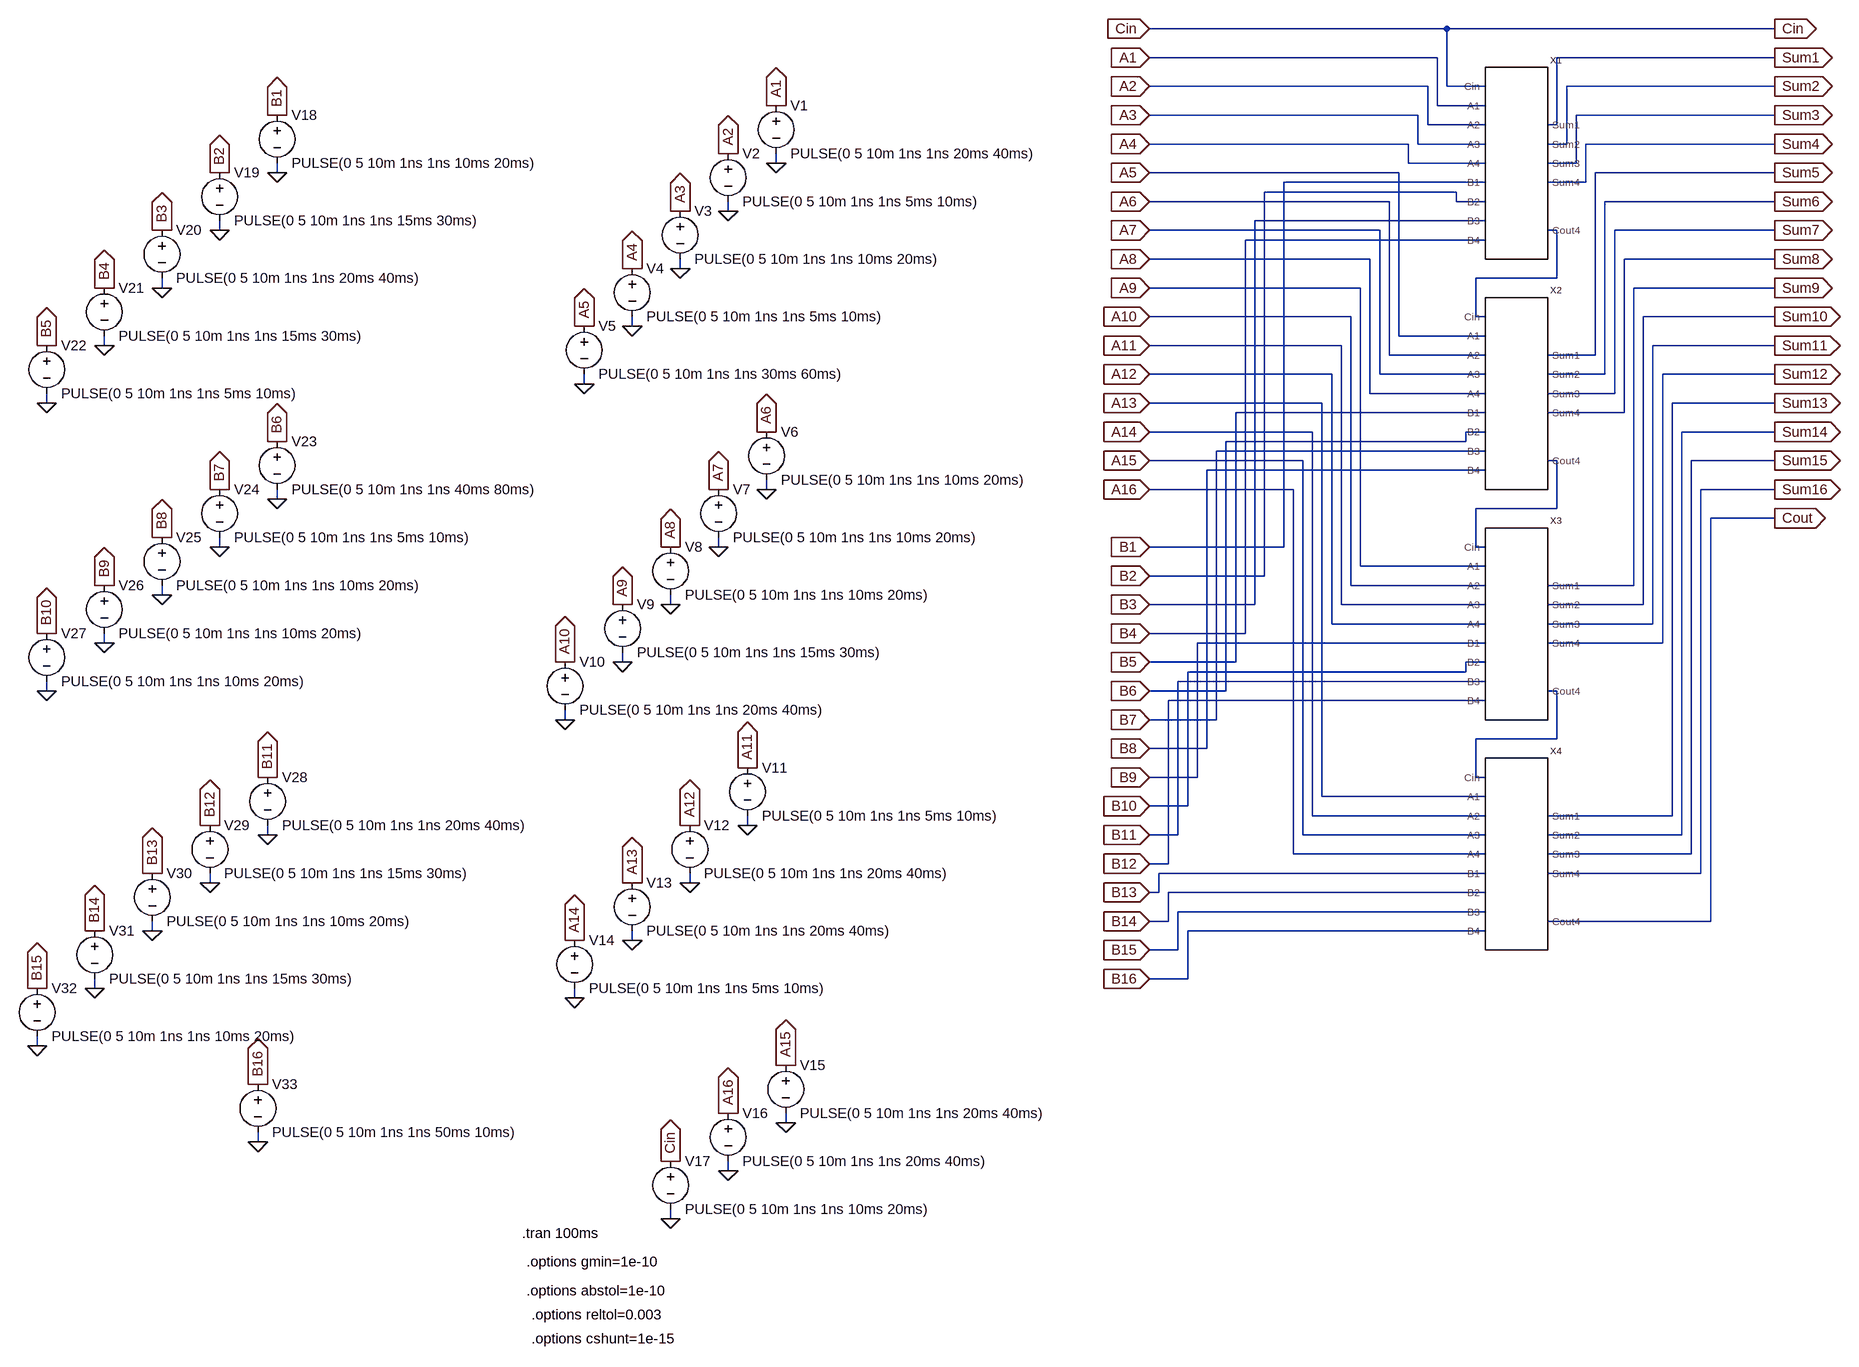
[diagram p0: schematic 16_bit_Full_Adder.asc]
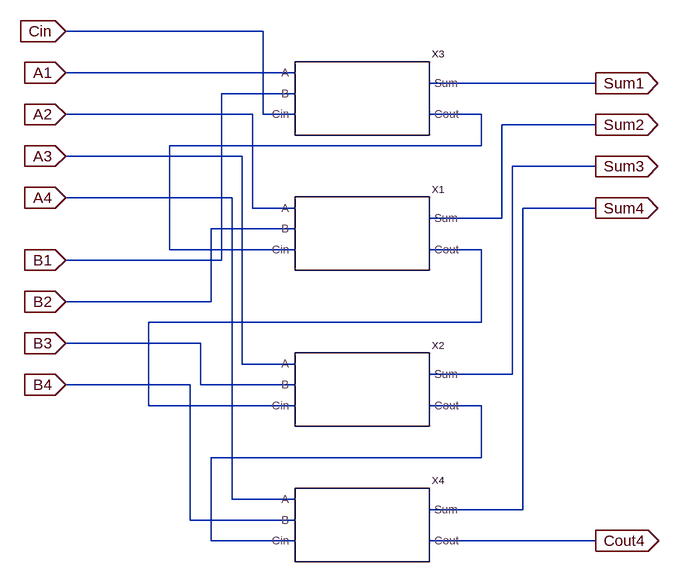
[diagram p1: sub-circuit 8pin_in_full_adder.asc]
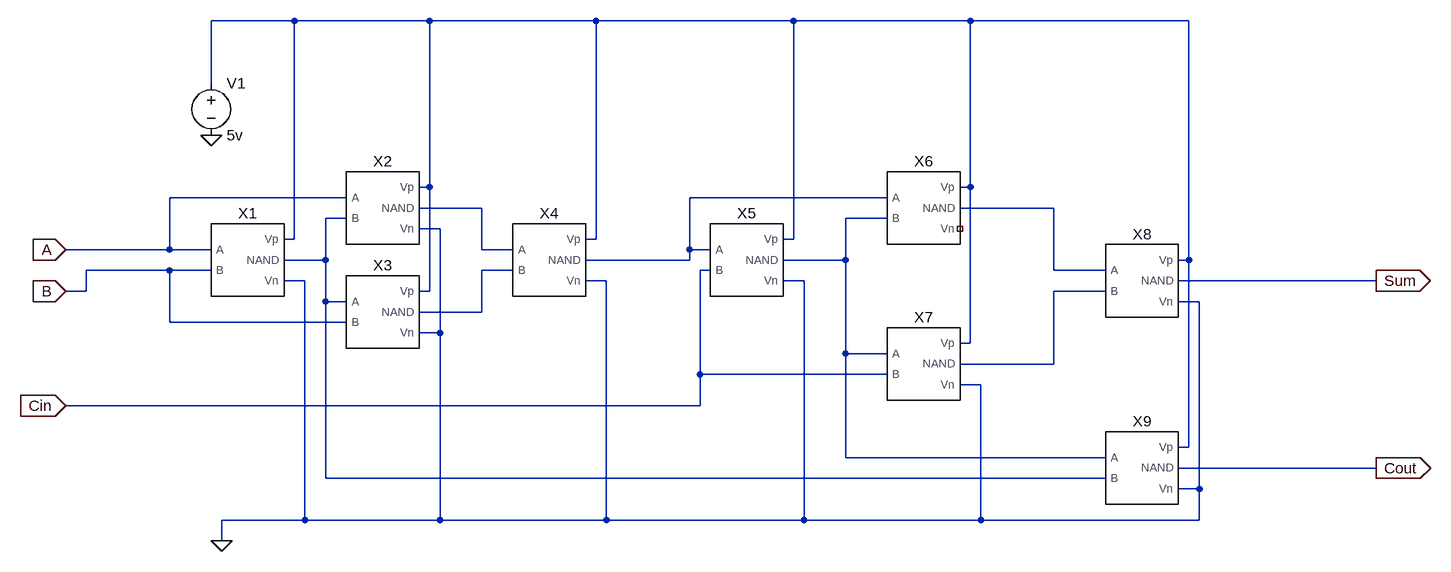
[diagram p2: sub-circuit 1_bit_full_adder.asc]
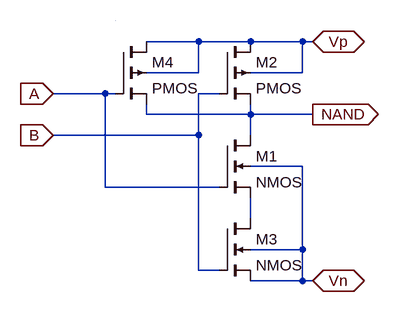
[diagram p3: sub-circuit cmos-nand.asc]
16_bit_Full_Adder.asc, the LTspice schematic file:
Version 4
SHEET 1 880 2136
WIRE -528 -64 -1024 -64
WIRE 112 -64 -528 -64
WIRE -544 -16 -1024 -16
WIRE 112 -16 -256 -16
WIRE -560 32 -1024 32
WIRE -528 32 -528 -64
WIRE -464 32 -528 32
WIRE 112 32 -240 32
WIRE -544 64 -544 -16
WIRE -464 64 -544 64
WIRE -576 80 -1024 80
WIRE 112 80 -224 80
WIRE -560 96 -560 32
WIRE -464 96 -560 96
WIRE -256 96 -256 -16
WIRE -256 96 -272 96
WIRE -592 128 -1024 128
WIRE -576 128 -576 80
WIRE -464 128 -576 128
WIRE -240 128 -240 32
WIRE -240 128 -272 128
WIRE 112 128 -208 128
WIRE -2016 160 -2016 144
WIRE -592 160 -592 128
WIRE -464 160 -592 160
WIRE -224 160 -224 80
WIRE -224 160 -272 160
WIRE -2848 176 -2848 160
WIRE -608 176 -1024 176
WIRE 112 176 -192 176
WIRE -464 192 -800 192
WIRE -208 192 -208 128
WIRE -208 192 -272 192
WIRE -512 208 -832 208
WIRE -624 224 -1024 224
WIRE -512 224 -512 208
WIRE -464 224 -512 224
WIRE 112 224 -176 224
WIRE -2096 240 -2096 224
WIRE -464 256 -848 256
WIRE -2944 272 -2944 256
WIRE -640 272 -1024 272
WIRE -256 272 -272 272
WIRE 112 272 -160 272
WIRE -464 288 -864 288
WIRE -656 320 -1024 320
WIRE 112 320 -144 320
WIRE -2176 336 -2176 320
WIRE -256 352 -256 272
WIRE -256 352 -480 352
WIRE -3040 368 -3040 352
WIRE -672 368 -1024 368
WIRE 112 368 -128 368
WIRE -688 416 -1024 416
WIRE -480 416 -480 352
WIRE -464 416 -480 416
WIRE 112 416 -112 416
WIRE -2256 432 -2256 416
WIRE -608 448 -608 176
WIRE -464 448 -608 448
WIRE -3136 464 -3136 448
WIRE -704 464 -1024 464
WIRE 112 464 -96 464
WIRE -624 480 -624 224
WIRE -464 480 -624 480
WIRE -192 480 -192 176
WIRE -192 480 -272 480
WIRE -720 512 -1024 512
WIRE -640 512 -640 272
WIRE -464 512 -640 512
WIRE -176 512 -176 224
WIRE -176 512 -272 512
WIRE 112 512 -80 512
WIRE -2336 528 -2336 512
WIRE -656 544 -656 320
WIRE -464 544 -656 544
WIRE -160 544 -160 272
WIRE -160 544 -272 544
WIRE -3232 560 -3232 544
WIRE -736 560 -1024 560
WIRE 112 560 -64 560
WIRE -464 576 -880 576
WIRE -144 576 -144 320
WIRE -144 576 -272 576
WIRE -752 608 -1024 608
WIRE -464 608 -496 608
WIRE 112 608 -48 608
WIRE -496 624 -496 608
WIRE -496 624 -896 624
WIRE -464 640 -912 640
WIRE -768 656 -1024 656
WIRE -256 656 -272 656
WIRE 112 656 -32 656
WIRE -464 672 -928 672
WIRE -2032 704 -2032 688
WIRE -784 704 -1024 704
WIRE 112 704 -16 704
WIRE -2848 720 -2848 704
WIRE -256 736 -256 656
WIRE -256 736 -480 736
WIRE 112 752 0 752
WIRE -2944 800 -2944 784
WIRE -2112 800 -2112 784
WIRE -800 800 -800 192
WIRE -800 800 -1024 800
WIRE -480 800 -480 736
WIRE -464 800 -480 800
WIRE -672 832 -672 368
WIRE -464 832 -672 832
WIRE -832 848 -832 208
WIRE -832 848 -1024 848
WIRE -688 864 -688 416
WIRE -464 864 -688 864
WIRE -128 864 -128 368
WIRE -128 864 -272 864
WIRE -3040 880 -3040 864
WIRE -2192 896 -2192 880
WIRE -848 896 -848 256
WIRE -848 896 -1024 896
WIRE -704 896 -704 464
WIRE -464 896 -704 896
WIRE -112 896 -112 416
WIRE -112 896 -272 896
WIRE -720 928 -720 512
WIRE -464 928 -720 928
WIRE -96 928 -96 464
WIRE -96 928 -272 928
WIRE -864 944 -864 288
WIRE -864 944 -1024 944
WIRE -3136 960 -3136 944
WIRE -464 960 -944 960
WIRE -80 960 -80 512
WIRE -80 960 -272 960
WIRE -2272 992 -2272 976
WIRE -880 992 -880 576
WIRE -880 992 -1024 992
WIRE -464 992 -496 992
WIRE -496 1008 -496 992
WIRE -496 1008 -960 1008
WIRE -464 1024 -976 1024
WIRE -3232 1040 -3232 1024
WIRE -896 1040 -896 624
WIRE -896 1040 -1024 1040
WIRE -256 1040 -272 1040
WIRE -464 1056 -992 1056
WIRE -2368 1088 -2368 1072
WIRE -912 1088 -912 640
WIRE -912 1088 -1024 1088
WIRE -256 1120 -256 1040
WIRE -256 1120 -480 1120
WIRE -928 1136 -928 672
WIRE -928 1136 -1024 1136
WIRE -944 1184 -944 960
WIRE -944 1184 -1024 1184
WIRE -480 1184 -480 1120
WIRE -464 1184 -480 1184
WIRE -736 1216 -736 560
WIRE -464 1216 -736 1216
WIRE -960 1232 -960 1008
WIRE -960 1232 -1024 1232
WIRE -752 1248 -752 608
WIRE -464 1248 -752 1248
WIRE -64 1248 -64 560
WIRE -64 1248 -272 1248
WIRE -2064 1264 -2064 1248
WIRE -2864 1280 -2864 1264
WIRE -976 1280 -976 1024
WIRE -976 1280 -1024 1280
WIRE -768 1280 -768 656
WIRE -464 1280 -768 1280
WIRE -48 1280 -48 608
WIRE -48 1280 -272 1280
WIRE -784 1312 -784 704
WIRE -464 1312 -784 1312
WIRE -32 1312 -32 656
WIRE -32 1312 -272 1312
WIRE -992 1328 -992 1056
WIRE -992 1328 -1024 1328
WIRE -464 1344 -1008 1344
WIRE -16 1344 -16 704
WIRE -16 1344 -272 1344
WIRE -2960 1360 -2960 1344
WIRE -2160 1360 -2160 1344
WIRE -1008 1376 -1008 1344
WIRE -1008 1376 -1024 1376
WIRE -464 1376 -992 1376
WIRE -464 1408 -976 1408
WIRE -992 1424 -992 1376
WIRE -992 1424 -1024 1424
WIRE 0 1424 0 752
WIRE 0 1424 -272 1424
WIRE -3056 1440 -3056 1424
WIRE -464 1440 -960 1440
WIRE -2256 1456 -2256 1440
WIRE -976 1472 -976 1408
WIRE -976 1472 -1024 1472
WIRE -960 1520 -960 1440
WIRE -960 1520 -1024 1520
WIRE -3152 1536 -3152 1520
WIRE -2352 1552 -2352 1536
WIRE -3248 1632 -3248 1616
WIRE -2000 1760 -2000 1744
WIRE -2880 1792 -2880 1776
WIRE -2096 1840 -2096 1824
WIRE -2192 1920 -2192 1904
FLAG 112 752 Cout
IOPIN 112 752 Out
FLAG -1024 -16 A1
IOPIN -1024 -16 In
FLAG -1024 32 A2
IOPIN -1024 32 In
FLAG -1024 80 A3
IOPIN -1024 80 In
FLAG -1024 -64 Cin
IOPIN -1024 -64 In
FLAG -1024 128 A4
IOPIN -1024 128 In
FLAG -1024 176 A5
IOPIN -1024 176 In
FLAG -1024 224 A6
IOPIN -1024 224 In
FLAG -1024 272 A7
IOPIN -1024 272 In
FLAG -1024 320 A8
IOPIN -1024 320 In
FLAG -1024 368 A9
IOPIN -1024 368 In
FLAG -1024 416 A10
IOPIN -1024 416 In
FLAG -1024 464 A11
IOPIN -1024 464 In
FLAG -1024 512 A12
IOPIN -1024 512 In
FLAG -1024 560 A13
IOPIN -1024 560 In
FLAG -1024 608 A14
IOPIN -1024 608 In
FLAG -1024 656 A15
IOPIN -1024 656 In
FLAG -1024 704 A16
IOPIN -1024 704 In
FLAG -1024 800 B1
IOPIN -1024 800 In
FLAG -1024 848 B2
IOPIN -1024 848 In
FLAG -1024 896 B3
IOPIN -1024 896 In
FLAG -1024 944 B4
IOPIN -1024 944 In
FLAG -1024 992 B5
IOPIN -1024 992 In
FLAG -1024 1040 B6
IOPIN -1024 1040 In
FLAG -1024 1088 B7
IOPIN -1024 1088 In
FLAG -1024 1136 B8
IOPIN -1024 1136 In
FLAG -1024 1184 B9
IOPIN -1024 1184 In
FLAG -1024 1232 B10
IOPIN -1024 1232 In
FLAG -1024 1280 B11
IOPIN -1024 1280 In
FLAG -1024 1328 B12
IOPIN -1024 1328 In
FLAG -1024 1376 B13
IOPIN -1024 1376 In
FLAG -1024 1424 B14
IOPIN -1024 1424 In
FLAG -1024 1472 B15
IOPIN -1024 1472 In
FLAG -1024 1520 B16
IOPIN -1024 1520 In
FLAG 112 -16 Sum1
IOPIN 112 -16 Out
FLAG 112 -64 Cin
IOPIN 112 -64 Out
FLAG 112 32 Sum2
IOPIN 112 32 Out
FLAG 112 80 Sum3
IOPIN 112 80 Out
FLAG 112 128 Sum4
IOPIN 112 128 Out
FLAG 112 176 Sum5
IOPIN 112 176 Out
FLAG 112 224 Sum6
IOPIN 112 224 Out
FLAG 112 272 Sum7
IOPIN 112 272 Out
FLAG 112 320 Sum8
IOPIN 112 320 Out
FLAG 112 368 Sum9
IOPIN 112 368 Out
FLAG 112 416 Sum10
IOPIN 112 416 Out
FLAG 112 464 Sum11
IOPIN 112 464 Out
FLAG 112 512 Sum12
IOPIN 112 512 Out
FLAG 112 560 Sum13
IOPIN 112 560 Out
FLAG 112 608 Sum14
IOPIN 112 608 Out
FLAG 112 656 Sum15
IOPIN 112 656 Out
FLAG 112 704 Sum16
IOPIN 112 704 Out
FLAG -2016 64 A1
IOPIN -2016 64 Out
FLAG -2016 160 0
FLAG -2096 144 A2
IOPIN -2096 144 Out
FLAG -2176 240 A3
IOPIN -2176 240 Out
FLAG -2256 336 A4
IOPIN -2256 336 Out
FLAG -2336 432 A5
IOPIN -2336 432 Out
FLAG -2032 608 A6
IOPIN -2032 608 Out
FLAG -2112 704 A7
IOPIN -2112 704 Out
FLAG -2192 800 A8
IOPIN -2192 800 Out
FLAG -2272 896 A9
IOPIN -2272 896 Out
FLAG -2368 992 A10
IOPIN -2368 992 Out
FLAG -2064 1168 A11
IOPIN -2064 1168 Out
FLAG -2160 1264 A12
IOPIN -2160 1264 Out
FLAG -2256 1360 A13
IOPIN -2256 1360 Out
FLAG -2352 1456 A14
IOPIN -2352 1456 Out
FLAG -2000 1664 A15
IOPIN -2000 1664 Out
FLAG -2096 1744 A16
IOPIN -2096 1744 Out
FLAG -2096 240 0
FLAG -2176 336 0
FLAG -2256 432 0
FLAG -2336 528 0
FLAG -2032 704 0
FLAG -2112 800 0
FLAG -2192 896 0
FLAG -2272 992 0
FLAG -2368 1088 0
FLAG -2064 1264 0
FLAG -2160 1360 0
FLAG -2256 1456 0
FLAG -2352 1552 0
FLAG -2000 1760 0
FLAG -2096 1840 0
FLAG -2192 1920 0
FLAG -2192 1824 Cin
IOPIN -2192 1824 Out
FLAG -2848 80 B1
IOPIN -2848 80 Out
FLAG -2944 176 B2
IOPIN -2944 176 Out
FLAG -3040 272 B3
IOPIN -3040 272 Out
FLAG -3136 368 B4
IOPIN -3136 368 Out
FLAG -3232 464 B5
IOPIN -3232 464 Out
FLAG -2848 624 B6
IOPIN -2848 624 Out
FLAG -2944 704 B7
IOPIN -2944 704 Out
FLAG -3040 784 B8
IOPIN -3040 784 Out
FLAG -3136 864 B9
IOPIN -3136 864 Out
FLAG -3232 944 B10
IOPIN -3232 944 Out
FLAG -2864 1184 B11
IOPIN -2864 1184 Out
FLAG -2960 1264 B12
IOPIN -2960 1264 Out
FLAG -3056 1344 B13
IOPIN -3056 1344 Out
FLAG -3152 1440 B14
IOPIN -3152 1440 Out
FLAG -3248 1536 B15
IOPIN -3248 1536 Out
FLAG -2880 1696 B16
IOPIN -2880 1696 Out
FLAG -2848 176 0
FLAG -2944 272 0
FLAG -3040 368 0
FLAG -3136 464 0
FLAG -3232 560 0
FLAG -2848 720 0
FLAG -2944 800 0
FLAG -3040 880 0
FLAG -3136 960 0
FLAG -3232 1040 0
FLAG -2864 1280 0
FLAG -2960 1360 0
FLAG -3056 1440 0
FLAG -3152 1536 0
FLAG -3248 1632 0
FLAG -2880 1792 0
SYMBOL 8pin_in_Full_Adder -320 128 R0
SYMATTR InstName X1
SYMBOL 8pin_in_Full_Adder -320 512 R0
SYMATTR InstName X2
SYMBOL 8pin_in_Full_Adder -320 896 R0
SYMATTR InstName X3
SYMBOL 8pin_in_Full_Adder -320 1280 R0
SYMATTR InstName X4
SYMBOL voltage -2016 48 R0
WINDOW 123 0 0 Left 0
WINDOW 39 0 0 Left 0
SYMATTR InstName V1
SYMATTR Value PULSE(0 5 10m 1ns 1ns 20ms 40ms)
SYMBOL voltage -2096 128 R0
WINDOW 123 0 0 Left 0
WINDOW 39 0 0 Left 0
SYMATTR InstName V2
SYMATTR Value PULSE(0 5 10m 1ns 1ns 5ms 10ms)
SYMBOL voltage -2176 224 R0
WINDOW 123 0 0 Left 0
WINDOW 39 0 0 Left 0
SYMATTR InstName V3
SYMATTR Value PULSE(0 5 10m 1ns 1ns 10ms 20ms)
SYMBOL voltage -2256 320 R0
WINDOW 123 0 0 Left 0
WINDOW 39 0 0 Left 0
SYMATTR InstName V4
SYMATTR Value PULSE(0 5 10m 1ns 1ns 5ms 10ms)
SYMBOL voltage -2336 416 R0
WINDOW 123 0 0 Left 0
WINDOW 39 0 0 Left 0
SYMATTR InstName V5
SYMATTR Value PULSE(0 5 10m 1ns 1ns 30ms 60ms)
SYMBOL voltage -2032 592 R0
WINDOW 123 0 0 Left 0
WINDOW 39 0 0 Left 0
SYMATTR InstName V6
SYMATTR Value PULSE(0 5 10m 1ns 1ns 10ms 20ms)
SYMBOL voltage -2112 688 R0
WINDOW 123 0 0 Left 0
WINDOW 39 0 0 Left 0
SYMATTR InstName V7
SYMATTR Value PULSE(0 5 10m 1ns 1ns 10ms 20ms)
SYMBOL voltage -2192 784 R0
WINDOW 123 0 0 Left 0
WINDOW 39 0 0 Left 0
SYMATTR InstName V8
SYMATTR Value PULSE(0 5 10m 1ns 1ns 10ms 20ms)
SYMBOL voltage -2272 880 R0
WINDOW 123 0 0 Left 0
WINDOW 39 0 0 Left 0
SYMATTR InstName V9
SYMATTR Value PULSE(0 5 10m 1ns 1ns 15ms 30ms)
SYMBOL voltage -2368 976 R0
WINDOW 123 0 0 Left 0
WINDOW 39 0 0 Left 0
SYMATTR InstName V10
SYMATTR Value PULSE(0 5 10m 1ns 1ns 20ms 40ms)
SYMBOL voltage -2064 1152 R0
WINDOW 123 0 0 Left 0
WINDOW 39 0 0 Left 0
SYMATTR InstName V11
SYMATTR Value PULSE(0 5 10m 1ns 1ns 5ms 10ms)
SYMBOL voltage -2160 1248 R0
WINDOW 123 0 0 Left 0
WINDOW 39 0 0 Left 0
SYMATTR InstName V12
SYMATTR Value PULSE(0 5 10m 1ns 1ns 20ms 40ms)
SYMBOL voltage -2256 1344 R0
WINDOW 123 0 0 Left 0
WINDOW 39 0 0 Left 0
SYMATTR InstName V13
SYMATTR Value PULSE(0 5 10m 1ns 1ns 20ms 40ms)
SYMBOL voltage -2352 1440 R0
WINDOW 123 0 0 Left 0
WINDOW 39 0 0 Left 0
SYMATTR InstName V14
SYMATTR Value PULSE(0 5 10m 1ns 1ns 5ms 10ms)
SYMBOL voltage -2000 1648 R0
WINDOW 123 0 0 Left 0
WINDOW 39 0 0 Left 0
SYMATTR InstName V15
SYMATTR Value PULSE(0 5 10m 1ns 1ns 20ms 40ms)
SYMBOL voltage -2096 1728 R0
WINDOW 123 0 0 Left 0
WINDOW 39 0 0 Left 0
SYMATTR InstName V16
SYMATTR Value PULSE(0 5 10m 1ns 1ns 20ms 40ms)
SYMBOL voltage -2192 1808 R0
WINDOW 123 0 0 Left 0
WINDOW 39 0 0 Left 0
SYMATTR InstName V17
SYMATTR Value PULSE(0 5 10m 1ns 1ns 10ms 20ms)
SYMBOL voltage -2848 64 R0
WINDOW 123 0 0 Left 0
WINDOW 39 0 0 Left 0
SYMATTR InstName V18
SYMATTR Value PULSE(0 5 10m 1ns 1ns 10ms 20ms)
SYMBOL voltage -2944 160 R0
WINDOW 123 0 0 Left 0
WINDOW 39 0 0 Left 0
SYMATTR InstName V19
SYMATTR Value PULSE(0 5 10m 1ns 1ns 15ms 30ms)
SYMBOL voltage -3040 256 R0
WINDOW 123 0 0 Left 0
WINDOW 39 0 0 Left 0
SYMATTR InstName V20
SYMATTR Value PULSE(0 5 10m 1ns 1ns 20ms 40ms)
SYMBOL voltage -3136 352 R0
WINDOW 123 0 0 Left 0
WINDOW 39 0 0 Left 0
SYMATTR InstName V21
SYMATTR Value PULSE(0 5 10m 1ns 1ns 15ms 30ms)
SYMBOL voltage -3232 448 R0
WINDOW 123 0 0 Left 0
WINDOW 39 0 0 Left 0
SYMATTR InstName V22
SYMATTR Value PULSE(0 5 10m 1ns 1ns 5ms 10ms)
SYMBOL voltage -2848 608 R0
WINDOW 123 0 0 Left 0
WINDOW 39 0 0 Left 0
SYMATTR InstName V23
SYMATTR Value PULSE(0 5 10m 1ns 1ns 40ms 80ms)
SYMBOL voltage -2944 688 R0
WINDOW 123 0 0 Left 0
WINDOW 39 0 0 Left 0
SYMATTR InstName V24
SYMATTR Value PULSE(0 5 10m 1ns 1ns 5ms 10ms)
SYMBOL voltage -3040 768 R0
WINDOW 123 0 0 Left 0
WINDOW 39 0 0 Left 0
SYMATTR InstName V25
SYMATTR Value PULSE(0 5 10m 1ns 1ns 10ms 20ms)
SYMBOL voltage -3136 848 R0
WINDOW 123 0 0 Left 0
WINDOW 39 0 0 Left 0
SYMATTR InstName V26
SYMATTR Value PULSE(0 5 10m 1ns 1ns 10ms 20ms)
SYMBOL voltage -3232 928 R0
WINDOW 123 0 0 Left 0
WINDOW 39 0 0 Left 0
SYMATTR InstName V27
SYMATTR Value PULSE(0 5 10m 1ns 1ns 10ms 20ms)
SYMBOL voltage -2864 1168 R0
WINDOW 123 0 0 Left 0
WINDOW 39 0 0 Left 0
SYMATTR InstName V28
SYMATTR Value PULSE(0 5 10m 1ns 1ns 20ms 40ms)
SYMBOL voltage -2960 1248 R0
WINDOW 123 0 0 Left 0
WINDOW 39 0 0 Left 0
SYMATTR InstName V29
SYMATTR Value PULSE(0 5 10m 1ns 1ns 15ms 30ms)
SYMBOL voltage -3056 1328 R0
WINDOW 123 0 0 Left 0
WINDOW 39 0 0 Left 0
SYMATTR InstName V30
SYMATTR Value PULSE(0 5 10m 1ns 1ns 10ms 20ms)
SYMBOL voltage -3152 1424 R0
WINDOW 123 0 0 Left 0
WINDOW 39 0 0 Left 0
SYMATTR InstName V31
SYMATTR Value PULSE(0 5 10m 1ns 1ns 15ms 30ms)
SYMBOL voltage -3248 1520 R0
WINDOW 123 0 0 Left 0
WINDOW 39 0 0 Left 0
SYMATTR InstName V32
SYMATTR Value PULSE(0 5 10m 1ns 1ns 10ms 20ms)
SYMBOL voltage -2880 1680 R0
WINDOW 123 0 0 Left 0
WINDOW 39 0 0 Left 0
SYMATTR InstName V33
SYMATTR Value PULSE(0 5 10m 1ns 1ns 50ms 10ms)
TEXT -2440 1944 Left 2 !.tran 100ms
TEXT -2432 1992 Left 2 !.options gmin=1e-10
TEXT -2432 2040 Left 2 !.options abstol=1e-10
TEXT -2424 2080 Left 2 !.options reltol=0.003
TEXT -2424 2120 Left 2 !.options cshunt=1e-15

8pin_in_full_adder.asc, the sub-circuit schematic file:
Version 4
SHEET 1 880 680
WIRE 0 -208 -304 -208
WIRE 48 -144 -304 -144
WIRE 512 -128 256 -128
WIRE 48 -112 -64 -112
WIRE -16 -80 -304 -80
WIRE 0 -80 0 -208
WIRE 48 -80 0 -80
WIRE 336 -80 256 -80
WIRE 512 -64 368 -64
WIRE 336 -32 336 -80
WIRE 336 -32 -144 -32
WIRE -32 -16 -304 -16
WIRE 512 0 384 0
WIRE -48 48 -304 48
WIRE -16 64 -16 -80
WIRE 48 64 -16 64
WIRE 512 64 400 64
WIRE 368 80 368 -64
WIRE 368 80 256 80
WIRE 48 96 -80 96
WIRE -144 128 -144 -32
WIRE 48 128 -144 128
WIRE 336 128 256 128
WIRE -64 144 -64 -112
WIRE -64 144 -304 144
WIRE -80 208 -80 96
WIRE -80 208 -304 208
WIRE 336 240 336 128
WIRE 336 240 -176 240
WIRE -96 272 -304 272
WIRE -32 304 -32 -16
WIRE 48 304 -32 304
WIRE 384 320 384 0
WIRE 384 320 256 320
WIRE -112 336 -304 336
WIRE -96 336 -96 272
WIRE 48 336 -96 336
WIRE -176 368 -176 240
WIRE 48 368 -176 368
WIRE 336 368 256 368
WIRE 336 448 336 368
WIRE 336 448 -80 448
WIRE -48 512 -48 48
WIRE 48 512 -48 512
WIRE 400 528 400 64
WIRE 400 528 256 528
WIRE -112 544 -112 336
WIRE 48 544 -112 544
WIRE -80 576 -80 448
WIRE 48 576 -80 576
WIRE 512 576 256 576
FLAG -304 -144 A1
IOPIN -304 -144 In
FLAG -304 -80 A2
IOPIN -304 -80 In
FLAG -304 -16 A3
IOPIN -304 -16 In
FLAG -304 48 A4
IOPIN -304 48 In
FLAG -304 144 B1
IOPIN -304 144 In
FLAG -304 208 B2
IOPIN -304 208 In
FLAG -304 272 B3
IOPIN -304 272 In
FLAG -304 336 B4
IOPIN -304 336 In
FLAG 512 -128 Sum1
IOPIN 512 -128 Out
FLAG 512 -64 Sum2
IOPIN 512 -64 Out
FLAG 512 0 Sum3
IOPIN 512 0 Out
FLAG 512 64 Sum4
IOPIN 512 64 Out
FLAG 512 576 Cout4
IOPIN 512 576 Out
FLAG -304 -208 Cin
IOPIN -304 -208 In
SYMBOL 1_Bit_Full_Adder 144 112 R0
SYMATTR InstName X1
SYMBOL 1_Bit_Full_Adder 144 352 R0
SYMATTR InstName X2
SYMBOL 1_Bit_Full_Adder 144 -96 R0
SYMATTR InstName X3
SYMBOL 1_Bit_Full_Adder 144 560 R0
SYMATTR InstName X4

1_bit_full_adder.asc, the sub-circuit schematic file:
Version 4
SHEET 1 1792 680
WIRE 16 -176 -112 -176
WIRE 224 -176 16 -176
WIRE 480 -176 224 -176
WIRE 784 -176 480 -176
WIRE 1056 -176 784 -176
WIRE 1392 -176 1056 -176
WIRE -112 -80 -112 -176
WIRE 224 80 224 -176
WIRE 224 80 208 80
WIRE 1056 80 1056 -176
WIRE 1056 80 1040 80
WIRE 96 96 -176 96
WIRE 928 96 624 96
WIRE 304 112 208 112
WIRE 1184 112 1040 112
WIRE 96 128 64 128
WIRE 928 128 864 128
WIRE 240 144 208 144
WIRE 16 160 16 -176
WIRE 16 160 0 160
WIRE 480 160 480 -176
WIRE 480 160 464 160
WIRE 784 160 784 -176
WIRE 784 160 768 160
WIRE -176 176 -176 96
WIRE -176 176 -336 176
WIRE -112 176 -176 176
WIRE 304 176 304 112
WIRE 352 176 304 176
WIRE 624 176 624 96
WIRE 656 176 624 176
WIRE 64 192 64 128
WIRE 64 192 0 192
WIRE 624 192 624 176
WIRE 624 192 464 192
WIRE 864 192 864 128
WIRE 864 192 768 192
WIRE 1392 192 1392 -176
WIRE 1392 192 1376 192
WIRE -176 208 -304 208
WIRE -112 208 -176 208
WIRE 352 208 304 208
WIRE 656 208 640 208
WIRE 1184 208 1184 112
WIRE 1264 208 1184 208
WIRE 32 224 0 224
WIRE 496 224 464 224
WIRE 800 224 768 224
WIRE 1680 224 1376 224
WIRE -304 240 -304 208
WIRE -304 240 -336 240
WIRE 224 240 224 80
WIRE 224 240 208 240
WIRE 1264 240 1184 240
WIRE 64 256 64 192
WIRE 96 256 64 256
WIRE 1408 256 1376 256
WIRE 304 272 304 208
WIRE 304 272 208 272
WIRE -176 288 -176 208
WIRE 96 288 -176 288
WIRE 240 304 240 144
WIRE 240 304 208 304
WIRE 1056 320 1056 80
WIRE 1056 320 1040 320
WIRE 864 336 864 192
WIRE 928 336 864 336
WIRE 1184 352 1184 240
WIRE 1184 352 1040 352
WIRE 640 368 640 208
WIRE 928 368 640 368
WIRE 1072 384 1040 384
WIRE 640 416 640 368
WIRE 640 416 -336 416
WIRE 1392 480 1392 192
WIRE 1392 480 1376 480
WIRE 864 496 864 336
WIRE 1264 496 864 496
WIRE 1680 512 1376 512
WIRE 64 528 64 256
WIRE 1264 528 64 528
WIRE 1408 544 1408 256
WIRE 1408 544 1376 544
WIRE 32 592 32 224
WIRE 32 592 -96 592
WIRE 240 592 240 304
WIRE 240 592 32 592
WIRE 496 592 496 224
WIRE 496 592 240 592
WIRE 800 592 800 224
WIRE 800 592 496 592
WIRE 1072 592 1072 384
WIRE 1072 592 800 592
WIRE 1408 592 1408 544
WIRE 1408 592 1072 592
WIRE -96 624 -96 592
FLAG -96 624 0
FLAG -336 176 A
IOPIN -336 176 In
FLAG -336 240 B
IOPIN -336 240 In
FLAG -336 416 Cin
IOPIN -336 416 In
FLAG 1680 512 Cout
IOPIN 1680 512 Out
FLAG 1680 224 Sum
IOPIN 1680 224 Out
FLAG -112 0 0
SYMBOL cmos-nand -64 192 R0
SYMATTR InstName X1
SYMBOL cmos-nand 144 112 R0
SYMATTR InstName X2
SYMBOL cmos-nand 144 272 R0
SYMATTR InstName X3
SYMBOL cmos-nand 400 192 R0
SYMATTR InstName X4
SYMBOL cmos-nand 704 192 R0
SYMATTR InstName X5
SYMBOL cmos-nand 976 112 R0
SYMATTR InstName X6
SYMBOL cmos-nand 976 352 R0
SYMATTR InstName X7
SYMBOL cmos-nand 1312 224 R0
SYMATTR InstName X8
SYMBOL cmos-nand 1312 512 R0
SYMATTR InstName X9
SYMBOL voltage -112 -96 R0
WINDOW 123 0 0 Left 0
WINDOW 39 0 0 Left 0
SYMATTR InstName V1
SYMATTR Value 5v

cmos-nand.asc, the sub-circuit schematic file:
Version 4
SHEET 1 880 680
WIRE 128 32 48 32
WIRE 208 32 128 32
WIRE 288 32 208 32
WIRE 304 32 288 32
WIRE 128 80 128 32
WIRE 128 80 48 80
WIRE 288 80 288 32
WIRE 288 80 208 80
WIRE -16 112 -96 112
WIRE 0 112 -16 112
WIRE 160 112 128 112
WIRE 48 144 48 128
WIRE 208 144 208 128
WIRE 208 144 48 144
WIRE 304 144 208 144
WIRE 128 176 128 112
WIRE 128 176 -96 176
WIRE 208 176 208 144
WIRE 288 224 208 224
WIRE -16 256 -16 112
WIRE 160 256 -16 256
WIRE 208 304 208 272
WIRE 288 352 288 224
WIRE 288 352 208 352
WIRE 128 384 128 176
WIRE 160 384 128 384
WIRE 288 400 288 352
WIRE 288 400 208 400
WIRE 304 400 288 400
WIRE 0 0 0 0
FLAG 304 32 Vp
IOPIN 304 32 BiDir
FLAG 304 400 Vn
IOPIN 304 400 BiDir
FLAG 304 144 NAND
IOPIN 304 144 Out
FLAG -96 112 A
IOPIN -96 112 In
FLAG -96 176 B
IOPIN -96 176 In
SYMBOL nmos4 160 176 R0
SYMATTR InstName M1
SYMBOL pmos4 160 32 R0
SYMATTR InstName M2
SYMBOL nmos4 160 304 R0
SYMATTR InstName M3
SYMBOL pmos4 0 32 R0
SYMATTR InstName M4

The netlist it stands for:
* 16_bit_Full_Adder.asc
XX1 A1 A2 A3 A4 B1 B2 B3 B4 Sum1 Sum2 Sum3 Sum4 N001 Cin 8pin_in_full_adder
XX2 A5 A6 A7 A8 B5 B6 B7 B8 Sum5 Sum6 Sum7 Sum8 N002 N001 8pin_in_full_adder
XX3 A9 A10 A11 A12 B9 B10 B11 B12 Sum9 Sum10 Sum11 Sum12 N003 N002 8pin_in_full_adder
XX4 A13 A14 A15 A16 B13 B14 B15 B16 Sum13 Sum14 Sum15 Sum16 Cout N003 8pin_in_full_adder
V1 A1 0 PULSE(0 5 10m 1ns 1ns 20ms 40ms)
V2 A2 0 PULSE(0 5 10m 1ns 1ns 5ms 10ms)
V3 A3 0 PULSE(0 5 10m 1ns 1ns 10ms 20ms)
V4 A4 0 PULSE(0 5 10m 1ns 1ns 5ms 10ms)
V5 A5 0 PULSE(0 5 10m 1ns 1ns 30ms 60ms)
V6 A6 0 PULSE(0 5 10m 1ns 1ns 10ms 20ms)
V7 A7 0 PULSE(0 5 10m 1ns 1ns 10ms 20ms)
V8 A8 0 PULSE(0 5 10m 1ns 1ns 10ms 20ms)
V9 A9 0 PULSE(0 5 10m 1ns 1ns 15ms 30ms)
V10 A10 0 PULSE(0 5 10m 1ns 1ns 20ms 40ms)
V11 A11 0 PULSE(0 5 10m 1ns 1ns 5ms 10ms)
V12 A12 0 PULSE(0 5 10m 1ns 1ns 20ms 40ms)
V13 A13 0 PULSE(0 5 10m 1ns 1ns 20ms 40ms)
V14 A14 0 PULSE(0 5 10m 1ns 1ns 5ms 10ms)
V15 A15 0 PULSE(0 5 10m 1ns 1ns 20ms 40ms)
V16 A16 0 PULSE(0 5 10m 1ns 1ns 20ms 40ms)
V17 Cin 0 PULSE(0 5 10m 1ns 1ns 10ms 20ms)
V18 B1 0 PULSE(0 5 10m 1ns 1ns 10ms 20ms)
V19 B2 0 PULSE(0 5 10m 1ns 1ns 15ms 30ms)
V20 B3 0 PULSE(0 5 10m 1ns 1ns 20ms 40ms)
V21 B4 0 PULSE(0 5 10m 1ns 1ns 15ms 30ms)
V22 B5 0 PULSE(0 5 10m 1ns 1ns 5ms 10ms)
V23 B6 0 PULSE(0 5 10m 1ns 1ns 40ms 80ms)
V24 B7 0 PULSE(0 5 10m 1ns 1ns 5ms 10ms)
V25 B8 0 PULSE(0 5 10m 1ns 1ns 10ms 20ms)
V26 B9 0 PULSE(0 5 10m 1ns 1ns 10ms 20ms)
V27 B10 0 PULSE(0 5 10m 1ns 1ns 10ms 20ms)
V28 B11 0 PULSE(0 5 10m 1ns 1ns 20ms 40ms)
V29 B12 0 PULSE(0 5 10m 1ns 1ns 15ms 30ms)
V30 B13 0 PULSE(0 5 10m 1ns 1ns 10ms 20ms)
V31 B14 0 PULSE(0 5 10m 1ns 1ns 15ms 30ms)
V32 B15 0 PULSE(0 5 10m 1ns 1ns 10ms 20ms)
V33 B16 0 PULSE(0 5 10m 1ns 1ns 50ms 10ms)

* block symbol definitions
.subckt 8pin_in_full_adder A1 A2 A3 A4 B1 B2 B3 B4 Sum1 Sum2 Sum3 Sum4 Cout4 Cin
XX1 A2 B2 N001 Sum2 N002 1_bit_full_adder
XX2 A3 B3 N002 Sum3 N003 1_bit_full_adder
XX3 A1 B1 Cin Sum1 N001 1_bit_full_adder
XX4 A4 B4 N003 Sum4 Cout4 1_bit_full_adder
.ends 8pin_in_full_adder

.subckt 1_bit_full_adder A B Cin Sum Cout
XX1 A B N005 0 N001 cmos-nand
XX2 A N005 N003 0 N001 cmos-nand
XX3 N005 B N007 0 N001 cmos-nand
XX4 N003 N007 N002 0 N001 cmos-nand
XX5 N002 Cin N006 0 N001 cmos-nand
XX6 N002 N006 N004 NC_01 N001 cmos-nand
XX7 N006 Cin N008 0 N001 cmos-nand
XX8 N004 N008 Sum 0 N001 cmos-nand
XX9 N006 N005 Cout 0 N001 cmos-nand
V1 N001 0 5v
.ends 1_bit_full_adder

.subckt cmos-nand A B NAND Vn Vp
M1 NAND A N001 Vn NMOS
M2 Vp B NAND Vp PMOS
M3 N001 B Vn Vn NMOS
M4 Vp A NAND Vp PMOS
.ends cmos-nand

.model NMOS NMOS
.model PMOS PMOS
.lib standard.mos
.tran 100ms
.options gmin=1e-10
.options abstol=1e-10
.options reltol=0.003
.options cshunt=1e-15
.backanno
.end

* Results of the author's LTspice run, read from the files saved beside the schematic
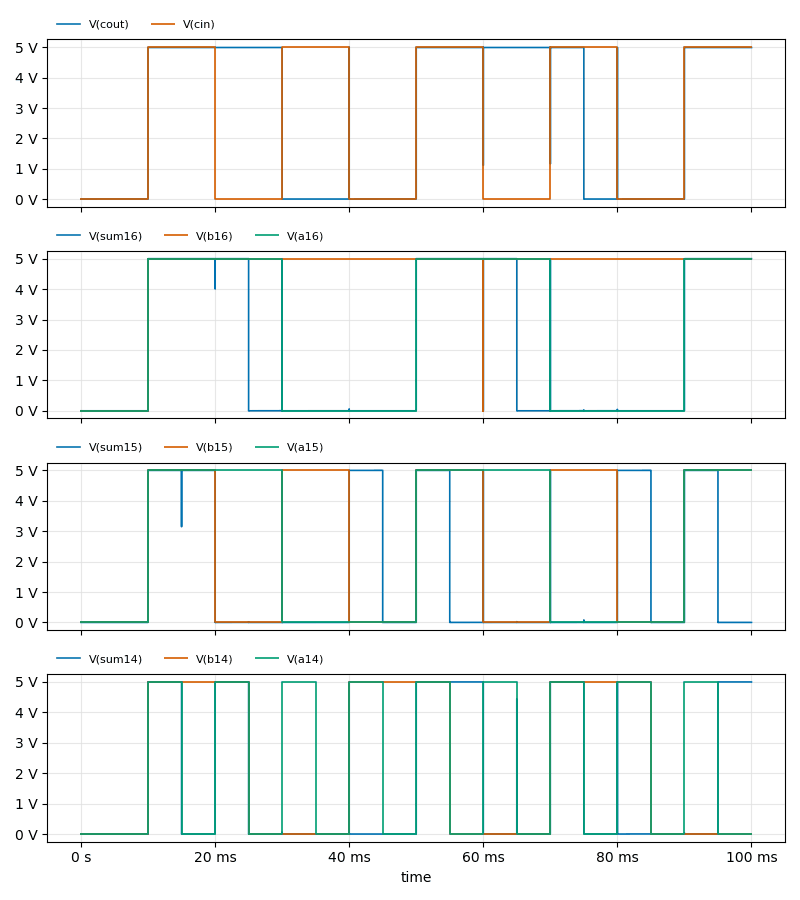
[diagram p4: Transient Analysis of 16_bit_Full_Adder.asc, plotted from the saved traces]
* Transient Analysis, 1 run:
*   V(cout): min -2.82 mV, max 5.014 V, average 2.75 V, rms 3.708 V, last 5 V
*   V(cin): min 0 V, max 5 V, average 2.5 V, rms 3.536 V, last 5 V
*   V(sum16): min -743.3 µV, max 5 V, average 2 V, rms 3.162 V, last 5 V
*   V(b16): min 0 V, max 5 V, average 4.5 V, rms 4.743 V, last 5 V
*   V(a16): min 0 V, max 5 V, average 2.5 V, rms 3.536 V, last 5 V
*   V(sum15): min -1.683 mV, max 5 V, average 1.5 V, rms 2.739 V, last 40.64 µV
*   V(b15): min 0 V, max 5 V, average 2.5 V, rms 3.536 V, last 5 V
*   V(a15): min 0 V, max 5 V, average 2.5 V, rms 3.536 V, last 5 V
*   V(sum14): min -3.66 mV, max 5 V, average 1.5 V, rms 2.739 V, last 5 V
*   V(b14): min 0 V, max 5 V, average 2.25 V, rms 3.354 V, last 0 V
*   V(a14): min 0 V, max 5 V, average 2.25 V, rms 3.354 V, last 0 V